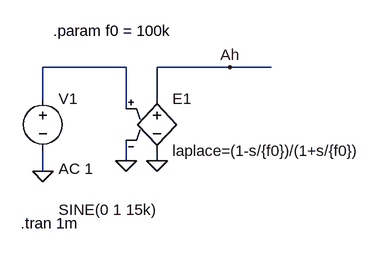
[diagram p0: schematic hilbert_transfer_s.asc]
hilbert_transfer_s.asc, the LTspice schematic file:
Version 4
SHEET 1 880 680
WIRE 112 96 -16 96
WIRE 272 96 160 96
WIRE 336 96 272 96
WIRE -16 144 -16 96
WIRE 160 144 160 96
WIRE 112 160 112 96
WIRE 112 240 112 208
WIRE 160 240 160 224
WIRE -16 256 -16 224
FLAG -16 256 0
FLAG 112 240 0
FLAG 160 240 0
FLAG 272 96 Ah
SYMBOL e 160 128 R0
SYMATTR InstName E1
SYMATTR Value laplace=(1-s/{f0})/(1+s/{f0})
SYMBOL voltage -16 128 R0
WINDOW 3 24 187 Left 2
WINDOW 123 24 124 Left 2
WINDOW 39 0 0 Left 2
SYMATTR InstName V1
SYMATTR Value SINE(0 1 15k)
SYMATTR Value2 AC 1
TEXT 0 40 Left 2 !.param f0 = 100k
TEXT -50 336 Left 2 !.tran 1m

The netlist it stands for:
* hilbert_transfer_s.asc
E1 Ah 0 N001 0 laplace=(1-s/{f0})/(1+s/{f0})
V1 N001 0 SINE(0 1 15k) AC 1
.param f0 = 100k
.tran 1m
.backanno
.end